# EAGLE design tinyha_blinds (EAGLE 7.5.0)
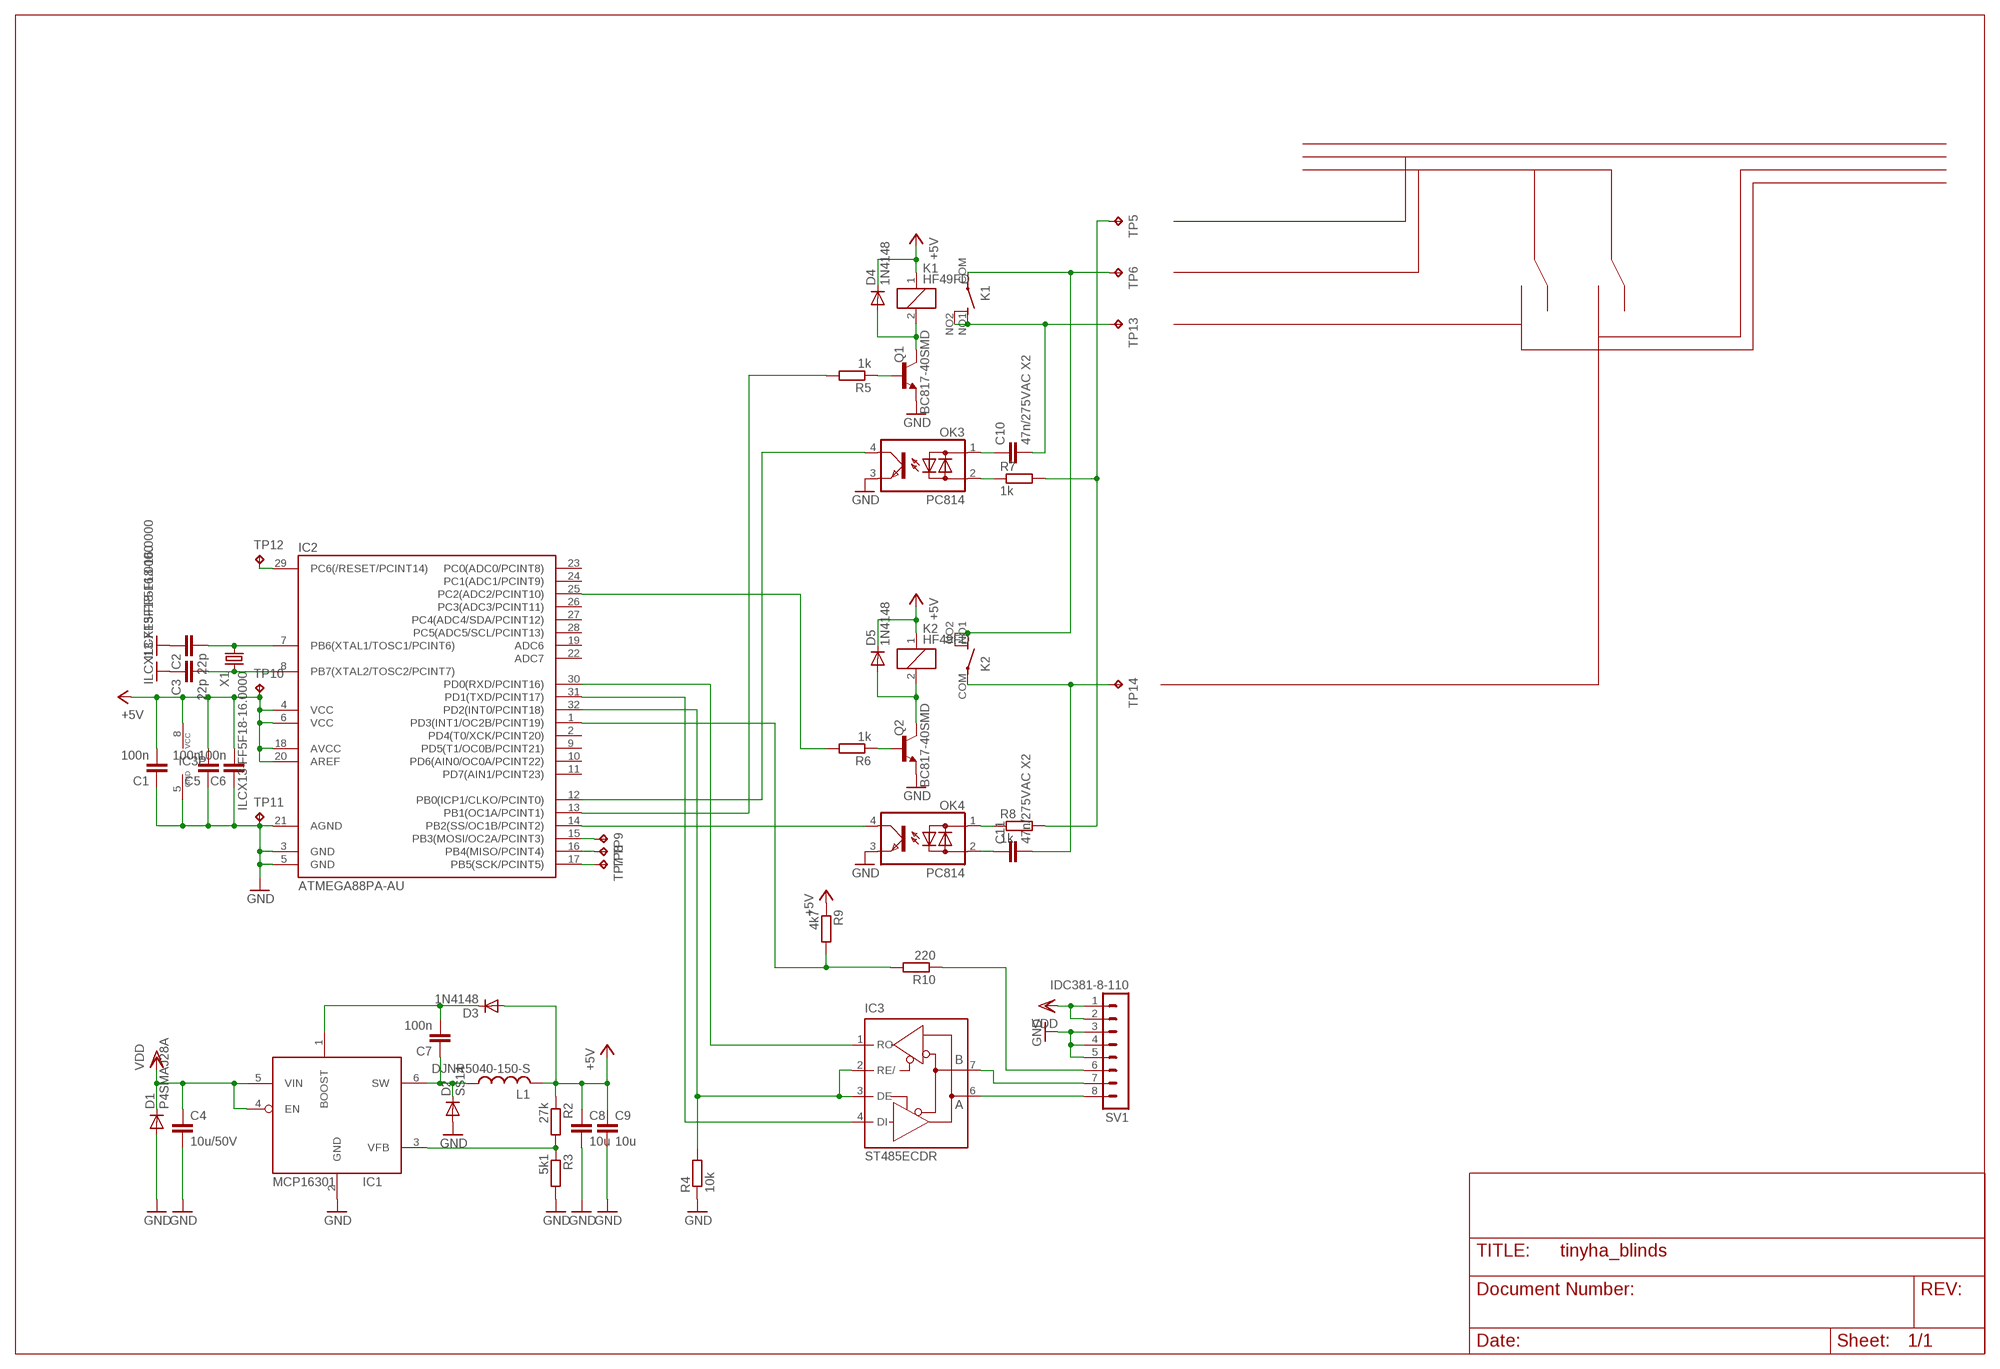
[diagram p0: schematic, sheet 1]

## Parts
C1  100n  C-EUC0603K  [C0603K]
C2  22p  C-EUC0603K  [C0603K]
C3  22p  C-EUC0603K  [C0603K]
C4  10u/50V  C-EUC1210K  [C1210K]
C5  100n  C-EUC0603K  [C0603K]
C6  100n  C-EUC0603K  [C0603K]
C7  100n  C-EUC0603K  [C0603K]
C8  10u  C-EUC0805K  [C0805K]
C9  10u  C-EUC0805K  [C0805K]
C10  47n/275VAC X2  C10/5  [C10B5]
C11  47n/275VAC X2  C10/5  [C10B5]
D1  P4SMAJ28A  DIODE-DO214AC  [DO214AC]
D2  SS14  DIODE-DO214AC  [DO214AC]
D3  1N4148  DIODE-MICROMELF-W  [MICROMELF-W]
D4  1N4148  DIODE-MICROMELF-W  [MICROMELF-W]
D5  1N4148  DIODE-MICROMELF-W  [MICROMELF-W]
IC1  MCP16301  [SOT23-6L]
IC2  ATMEGA88PA-AU  ATMEGA48/88/168-MU  [MLF32]
IC3  ST485ECDR  MAX481CSA  [SO08]
K1  HF49FD  [HF49D]
K2  HF49FD  [HF49D]
L1  DJNR5040-150-S  DJNR5040  [DJNR5040]
OK3  PC814  [DIL04]
OK4  PC814  [DIL04]
Q1  BC817-40SMD  [SOT23-BEC]
Q2  BC817-40SMD  [SOT23-BEC]
R2  27k  R-EU_R0603  [R0603]
R3  5k1  R-EU_R0603  [R0603]
R4  10k  R-EU_R0603  [R0603]
R5  1k  R-EU_R0603  [R0603]
R6  1k  R-EU_R0603  [R0603]
R7  1k  R-EU_0207/10  [0207/10]
R8  1k  R-EU_0207/10  [0207/10]
R9  4k7  R-EU_R0603  [R0603]
R10  220  R-EU_R0603  [R0603]
SV1  IDC381-8-110  MA08-1-IDC  [IDC381-8]
TP5  TP230  [P1-20]
TP6  TP230  [P1-20]
TP7  TPB1,27  [B1,27]
TP8  TPB1,27  [B1,27]
TP9  TPB1,27  [B1,27]
TP10  TPB1,27  [B1,27]
TP11  TPB1,27  [B1,27]
TP12  TPB1,27  [B1,27]
TP13  TP230  [P1-20]
TP14  TP230  [P1-20]
X1  ILCX13-FF5F18-16.0000  XTAL-3225  [SMD3225]

## Nets
+5V: C1.2 C5.2 C6.2 C8.1 C9.1 D3.A D4.C D5.C IC2.4(VCC) IC2.6(VCC) IC2.18(AVCC) IC2.20(AREF) IC3.8(VCC) K1.1 K2.1 L1.2 R2.1 R9.1 TP10.TP
DIR: IC2.32(PD2(INT0/PCINT18)) IC3.2(RE/) IC3.3(DE) R4.2
GND: C1.1 C2.1 C3.1 C4.2 C5.1 C6.1 C8.2 C9.2 D1.A D2.A IC1.2(GND) IC2.3(GND) IC2.5(GND) IC2.21(AGND) IC3.5(GND) OK3.3(E) OK4.3(E) Q1.E Q2.E R3.2 R4.1 SV1.3 SV1.4 SV1.5 TP11.TP X1.2(GND) X1.4(GND)
N$1: R7.2 R8.2 TP5.TP
N$2: C11.2 K2.COM(P) TP14.TP
N$3: C10.2 K1.NO1(S1) K1.NO2(S2) TP13.TP
N$4: Q2.B R6.1
N$5: Q1.B R5.1
N$6: IC2.13(PB1(OC1A/PCINT1)) R5.2
N$7: IC2.25(PC2(ADC2/PCINT10)) R6.2
N$8: IC2.29(PC6(/RESET/PCINT14)) TP12.TP
N$9: IC2.12(PB0(ICP1/CLKO/PCINT0)) OK3.4(C)
N$10: IC3.7(B) SV1.7
N$11: D5.A K2.2 Q2.C
N$12: IC2.14(PB2(SS/OC1B/PCINT2)) OK4.4(C)
N$13: OK4.1(AC1) R8.1
N$14: IC1.3(VFB) R2.2 R3.1
N$15: IC2.15(PB3(MOSI/OC2A/PCINT3)) TP9.TP
N$16: K1.COM(P) K2.NO1(S1) K2.NO2(S2) TP6.TP
N$17: C11.1 OK4.2(AC2)
N$18: R10.1 SV1.6
N$19: IC2.1(PD3(INT1/OC2B/PCINT19)) R9.2 R10.2
N$20: C7.1 D2.C IC1.6(SW) L1.1
N$21: D4.A K1.2 Q1.C
N$22: C7.2 D3.C IC1.1(BOOST)
N$23: IC3.6(A) SV1.8
N$24: C3.2 IC2.8(PB7(XTAL2/TOSC2/PCINT7)) X1.3
N$31: C2.2 IC2.7(PB6(XTAL1/TOSC1/PCINT6)) X1.1
N$55: C10.1 OK3.1(AC1)
N$56: OK3.2(AC2) R7.1
RXD: IC2.30(PD0(RXD/PCINT16)) IC3.1(RO)
TXD: IC2.31(PD1(TXD/PCINT17)) IC3.4(DI)
UH: IC2.16(PB4(MISO/PCINT4)) TP8.TP
VDD: C4.1 D1.C IC1.4(EN) IC1.5(VIN) SV1.1 SV1.2
WH: IC2.17(PB5(SCK/PCINT5)) TP7.TP
Unconnected: IC2.2(PD4(T0/XCK/PCINT20)) IC2.9(PD5(T1/OC0B/PCINT21)) IC2.10(PD6(AIN0/OC0A/PCINT22)) IC2.11(PD7(AIN1/PCINT23)) IC2.19(ADC6) IC2.22(ADC7) IC2.23(PC0(ADC0/PCINT8)) IC2.24(PC1(ADC1/PCINT9)) IC2.26(PC3(ADC3/PCINT11)) IC2.27(PC4(ADC4/SDA/PCINT12)) IC2.28(PC5(ADC5/SCL/PCINT13))

## Library data of the parts
C1-C9 = rcl:C-EU: CAPACITOR, European symbol
C10 C11 = capacitor-wima:C: CAPACITOR naming: grid - package width
D1-D5 = diode:DIODE-: DIODE
IC1 = custom:MCP16301
IC2 = atmega8:ATMEGA48/88/168
IC3 = maxim:MAX481CSA: RS485 TRANSEIVER; MF: MAXIM; MPN: MAX481CSA; OC_FARNELL: unknown; OC_NEWARK: 90C3817
K1 K2 = custom:HF49FD
L1 = custom:DJNR5040
OK3 OK4 = custom:PC814: SHARP OPTO COUPLER; OC_FARNELL: 9707662; OC_NEWARK: unknown
Q1 Q2 = transistor-npn:BC817*: NPN Transistor
R2-R10 = rcl:R-EU_: RESISTOR, European symbol
SV1 = custom:MA08-1: PIN HEADER
TP5 TP6 TP13 TP14 = custom:TP230
TP7-TP12 = testpad:TP: Test pad
X1 = custom:XTAL-3225

## Board
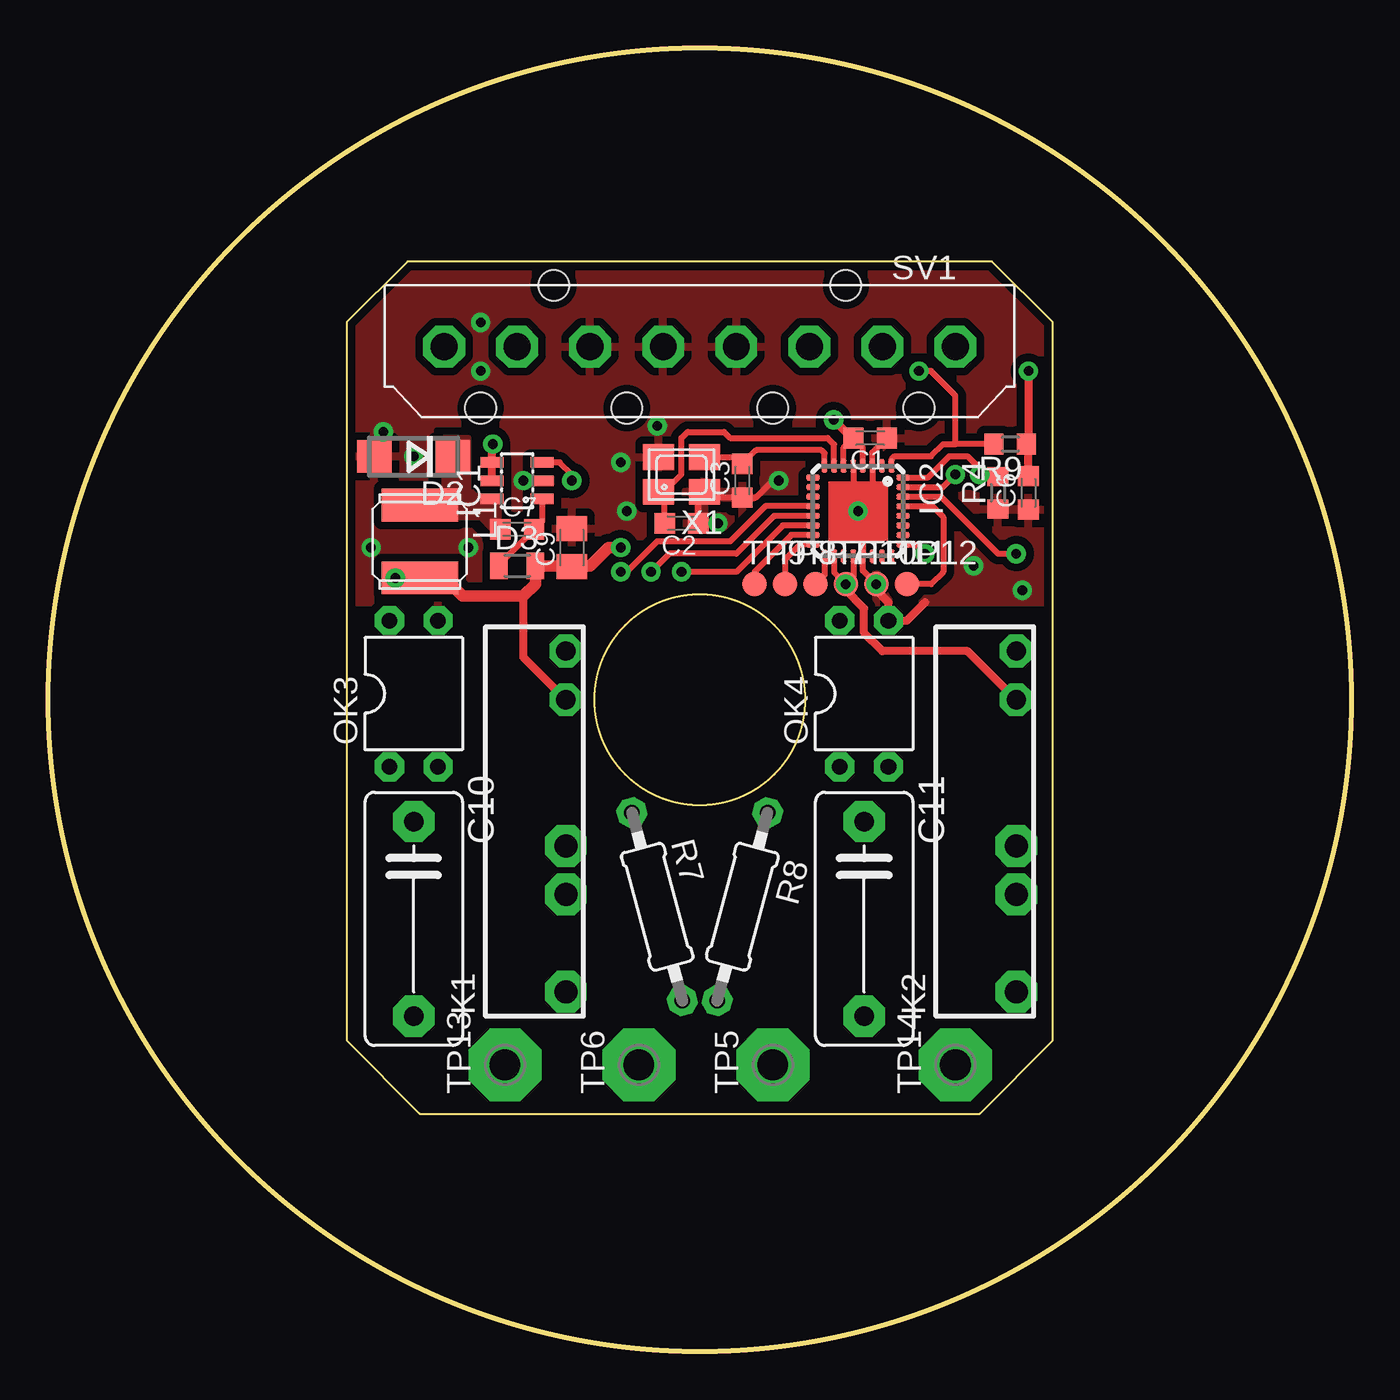
[diagram p1: board, top side]
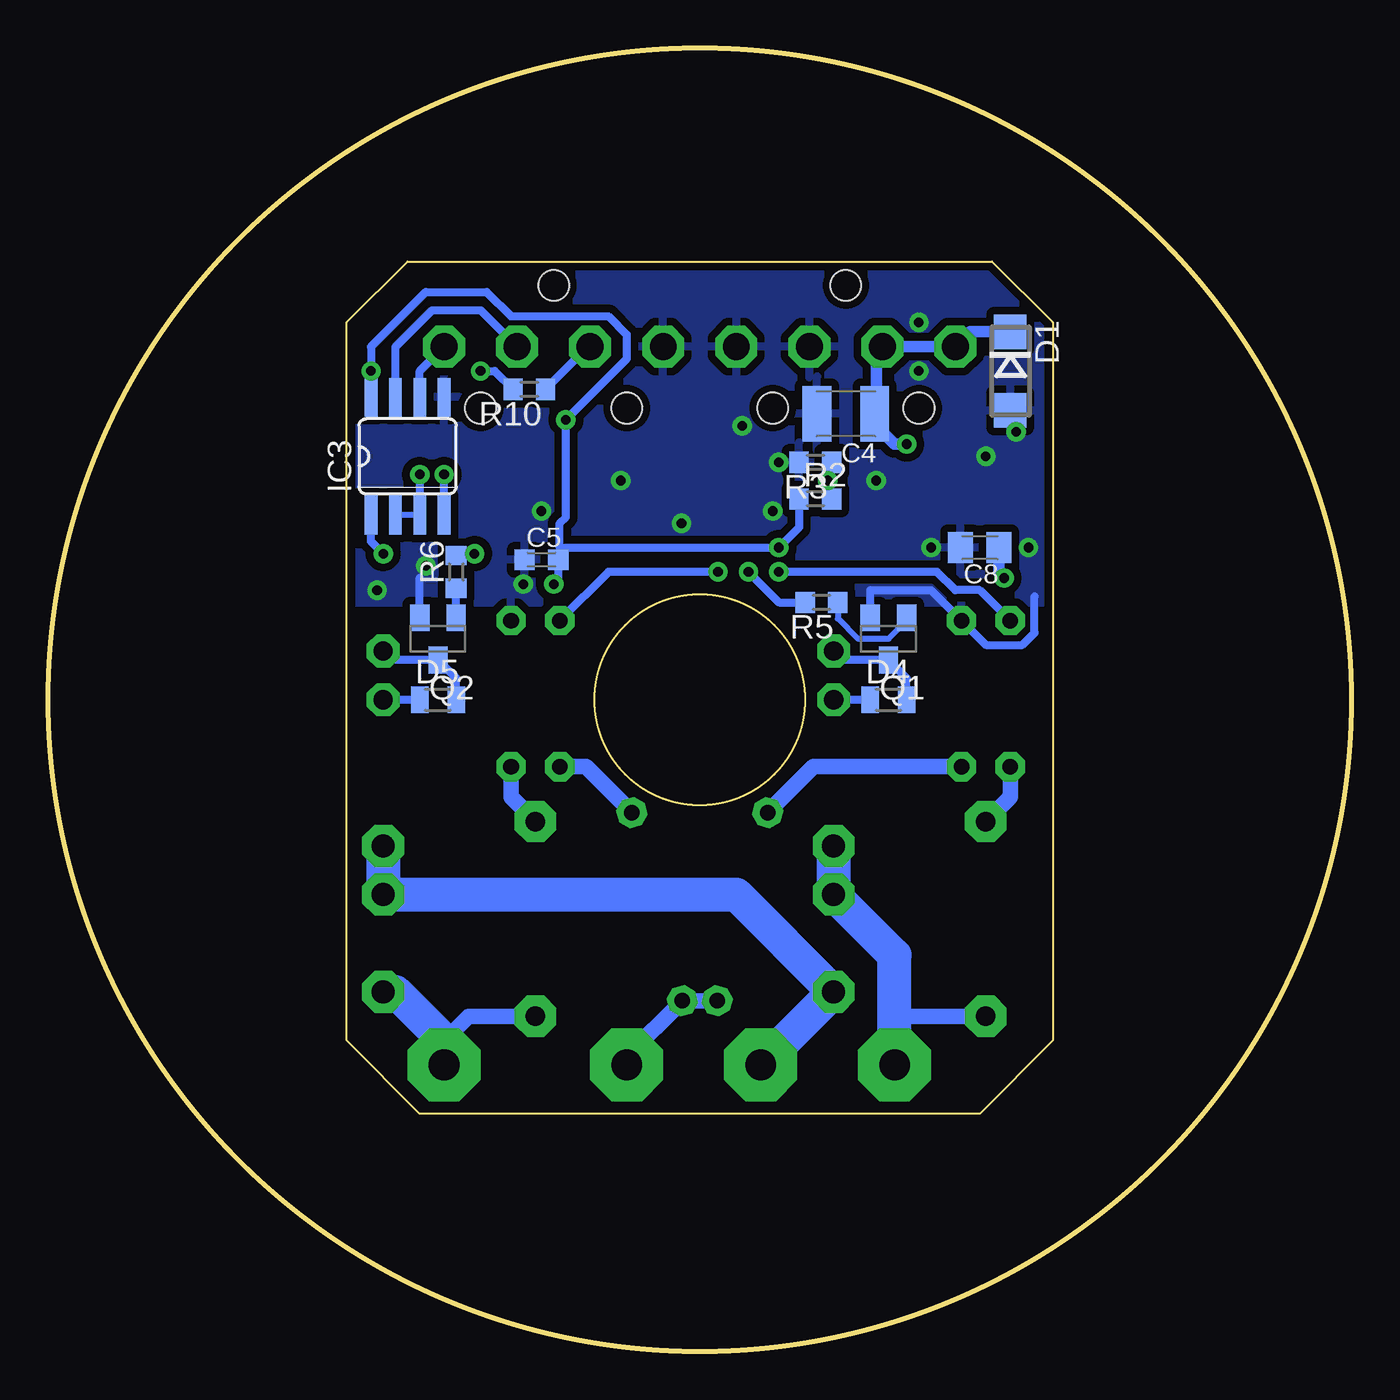
[diagram p2: board, bottom side, seen from below]

Size 68 x 68 mm. Coordinates in mm from the lower left corner, seen from the top.
Outline: 49.24,56.86 18.76,56.86 15.59,53.69 15.59,16.22 19.4,12.41 48.61,12.41 52.42,16.22 52.42,53.69 49.24,56.86
Outline: circle at 34,34 radius 34
Outline: circle at 34,34 radius 5.5
Copper layers (1*16): Top 0.035mm / dielectric 1.5mm / Bottom 0.035mm
Design rules "temp *": minimum track width 10mil, minimum drill 0.5mm, track to track 0.2mm, track to pad 0.2mm, pad to pad 0.2mm, via to via 0.2mm, smd to smd 0mil, copper to edge 16mil, drill to drill 8mil, minimum pad ring 14mil, minimum via ring 10mil, stop-mask expansion 4mil, vias tented up to drill 0.6mm, thermal gap 16mil

### Footprints (pad centres in the part's own frame; a part is rotated, then mirrored left to right if it is on the bottom)
C0603K = smd 1.05 x 1.08: 1 -0.875,0; 2 0.875,0
C1210K = smd 1.5 x 2.9: 1 -1.5,0; 2 1.5,0
C0805K = smd 1.3 x 1.6: 1 -1,0; 2 1,0
C10B5 = drill 1.016 pad 2.159 octagon: 1 -5.08,0; 2 5.08,0
DO214AC = smd 1.8 x 1.7: A 2.05,0; C -2.05,0
MICROMELF-W = smd 0.9 x 1.4: A 0.95,0; C -0.95,0
SOT23-6L = smd 0.55 x 1.2: 1 -0.95,-1.3; 2 0,-1.3; 3 0.95,-1.3; 4 0.95,1.3; 5 0,1.3; 6 -0.95,1.3
MLF32 = smd 0.7 x 0.3: 1 -2.35,1.75; 2 -2.35,1.25; 3 -2.35,0.75; 4 -2.35,0.25; 5 -2.35,-0.25; 6 -2.35,-0.75; 7 -2.35,-1.25; 8 -2.35,-1.75; 17 2.35,-1.75; 18 2.35,-1.25; 19 2.35,-0.75; 20 2.35,-0.25; 21 2.35,0.25; 22 2.35,0.75; 23 2.35,1.25; 24 2.35,1.75 | smd 0.3 x 0.7: 9 -1.75,-2.35; 10 -1.25,-2.35; 11 -0.75,-2.35; 12 -0.25,-2.35; 13 0.25,-2.35; 14 0.75,-2.35; 15 1.25,-2.35; 16 1.75,-2.35; 25 1.75,2.35; 26 1.25,2.35; 27 0.75,2.35; 28 0.25,2.35; 29 -0.25,2.35; 30 -0.75,2.35; 31 -1.25,2.35; 32 -1.75,2.35
SO08 = smd 0.66 x 2.032: 1 -1.905,-3.073; 2 -0.635,-3.073; 3 0.635,-3.073; 4 1.905,-3.073; 5 1.905,3.073; 6 0.635,3.073; 7 -0.635,3.073; 8 -1.905,3.073
HF49D = drill 1 pad 1.676 octagon: 1 7.62,0; 2 10.16,0 | drill 1.2 pad 2.184 octagon: COM -7.62,0; NO1 -2.54,0; NO2 0,0
DJNR5040 = smd 1.7 x 4: 1 -1.9,0; 2 1.9,0
DIL04 = drill 0.813 pad 1.422 octagon: 1 -1.27,-3.81; 2 1.27,-3.81; 3 1.27,3.81; 4 -1.27,3.81
SOT23-BEC = smd 1 x 1.4: B -0.95,-1.1; C 0,1.1; E 0.95,-1.1
R0603 = smd 1 x 1.1: 1 -0.85,0; 2 0.85,0
0207/10 = drill 0.813 octagon: 1 -5.08,0; 2 5.08,0
IDC381-8 = drill 1.4 pad 2.184 octagon: 1 -13.335,0; 2 -9.525,0; 3 -5.715,0; 4 -1.905,0; 5 1.905,0; 6 5.715,0; 7 9.525,0; 8 13.335,0 | hole 1.6: -11.43,-3.2; -3.81,-3.2; 3.81,-3.2; 11.43,-3.2; -7.62,3.2; 7.62,3.2
P1-20 = drill 1.6 pad 3.81 octagon: TP 0,0
B1,27 = smd 1.27 x 1.27: TP 0,0
SMD3225 = smd 1.6 x 1.35: 1 1.2,0.9; 2 -1.2,0.9; 3 -1.2,-0.9; 4 1.2,-0.9

### Placement (x,y rotation side)
C1  42.89,47.65 180 top
C2  33.05,43.21 180 top
C3  36.22,45.43 90 top
C4  26.38,48.92 180 bottom
C5  42.25,41.3 0 bottom
C6  51.14,44.8 90 top
C7  24.48,42.89 0 top
C8  19.4,41.94 180 bottom
C9  27.33,41.94 90 top
C10  19.08,22.57 270 top
C11  42.57,22.57 270 top
D1  17.81,51.14 270 bottom
D2  19.08,46.7 180 top
D3  24.48,40.98 0 top
D4  24.16,34 0 bottom
D5  47.65,34 0 bottom
IC1  24.48,45.43 90 top
IC2  42.25,43.84 270 top
IC3  49.24,46.7 0 bottom
K1  27.02,26.38 90 top
K2  50.51,26.38 90 top
L1  19.4,42.25 270 top
OK3  19.08,34.32 0 top
OK4  42.57,34.32 0 top
Q1  24.16,37.17 180 bottom
Q2  47.65,37.17 180 bottom
R2  27.97,44.48 0 bottom
R3  27.97,46.38 180 bottom
R4  49.56,44.8 90 top
R5  27.65,39.08 180 bottom
R6  46.7,40.67 90 bottom
R7  31.78,23.21 285 top
R8  36.22,23.21 255 top
R9  50.19,47.34 180 top
R10  42.89,50.19 180 bottom
SV1  34,52.42 0 top
TP5  37.81,14.95 90 top
TP6  30.82,14.95 90 top
TP7  40.03,40.03 0 top
TP8  38.45,40.03 0 top
TP9  36.86,40.03 0 top
TP10  41.62,40.03 0 top
TP11  43.21,40.03 0 top
TP12  44.8,40.03 0 top
TP13  23.84,14.95 90 top
TP14  47.34,14.95 90 top
X1  33.05,45.75 180 top

### Tracks (layer width: path | path; a pad name or v marks a point on that pad's centre or on a via)
+5V  (via drill 0.5)
  Top 0.305: IC2.18 41.01,40.65 TP10.TP 42,40.42 IC2.20 | IC2.4 42.5,47.16 C1.2 41.51,47.14 IC2.6
  Top 0.406: 19.78,39.97 L1.2 | C1.2 41.94,47.65 v40.98,48.61 | 24.79,39.4 24.79,36.22 K1.1 | K2.1 47.97,36.54 43.53,36.54 42.57,37.49 42.57,38.76 41.62,39.72 TP10.TP | C9.1 27.06,40.94 27.02,40.98 | v51.14,51.14 51.14,47.44 R9.1 51.14,47.23 C6.2
  Top 0.61: L1.2 20.66,40.35 21.62,39.4 24.79,39.4 25.43,40.03 D3.A 27.02,40.98 | v18.12,40.35 L1.2 | v29.87,41.94 29.24,41.94 28.29,40.98 27.38,40.98 C9.1
  Top 0.813: L1.2
  Bottom 0.406: TP10.TP 41.38,40.27 C5.2 41.3,41.38 41.3,41.94 | 41.3,41.94 41.3,43.21 40.98,43.53 v40.98,48.61 37.81,51.78 37.81,53.05 38.76,54 43.84,54 45.11,55.27 48.29,55.27 51.14,52.42 v51.14,51.14 IC3.8 | D4.C K1.1 | D5.C K2.1 | R2.1 28.82,42.99 v29.87,41.94 41.3,41.94
  Bottom 0.61: C8.1 18.4,40.62 v18.12,40.35
  other vias: 41.62,40.03
DIR  (via drill 0.5)
  Top 0.305: v48.61,45.75 48.61,46.06 47.97,46.7 47.02,46.7 45.91,45.59 IC2.32
  Top 0.406: v48.61,45.75 49.45,45.75 R4.2
  Bottom 0.305: IC3.3 IC3.2
  Bottom 0.406: v48.61,45.75 IC3.3
GND  (via drill 0.5)
  Top 0.305: C1.1 43,46.89 IC2.3 43,44.59 v42.25,43.84 | IC2.5 42,44.09 v42.25,43.84 | v42.25,43.84 42.5,43.59 IC2.21 42.5,40.73 TP11.TP | C2.1 33.92,44.52 X1.2 34.54,44.56 C3.1 36.94,44.56 37.81,45.43 v38.13,45.43
  Top 0.406: TP11.TP 43.21,39.72 43.84,39.08 OK4.3 44.8,38.13 45.75,39.08
  Bottom 0.406: 16.54,39.4 16.54,37.49 17.17,36.86 19.08,36.86 OK3.3 21.94,39.72 25.11,39.72 25.11,39.71 Q1.E | Q2.E 48.6,40.35 48.61,40.35
  other vias: 24.79,45.43 43.21,40.03 31.78,48.29 30.19,43.84 29.87,46.38 21.94,41.94 16.86,41.94 17.49,47.97 22.57,53.69 22.57,51.14 19.08,46.7 50.83,39.72 48.29,40.98 34.95,43.21
  pour Top (isolate 0.406, rank 2): 15.59,56.86 52.42,56.86 52.42,39.08 15.59,39.08
  pour Bottom (isolate 0.406): 15.59,56.86 52.42,56.86 52.42,39.08 15.59,39.08
N$1
  Bottom 0.813: R7.2 R8.2 37.81,15.4 TP5.TP
N$2
  Bottom 0.813: C11.2 46.06,17.49 47.34,16.22
  Bottom 1.778: K2.COM 49.88,18.76 47.34,16.22 TP14.TP
N$3
  Bottom 0.813: C10.2 23.84,17.49
  Bottom 1.778: TP13.TP 23.84,17.49 23.84,20.66 K1.NO1 K1.NO2
N$4
  Bottom 0.406: Q2.B R6.1
N$5
  Bottom 0.305: Q1.B 23.21,38.12 24.16,37.17 25.75,37.17 26.8,38.23 R5.1
N$6  (via drill 0.5)
  Top 0.305: IC2.13 37.88,43.59 35.91,41.62 32.41,41.62 v31.46,40.67
  Bottom 0.406: v31.46,40.67 29.87,39.08 R5.2
N$7  (via drill 0.5)
  Top 0.305: IC2.25 45.28,42.09 v45.75,41.62
  Bottom 0.406: v45.75,41.62 46.6,41.62 R6.2
N$8
  Top 0.305: 45.18,44.09 IC2.29 46.13,44.09 46.7,43.53 46.7,40.67 46.06,40.03 TP12.TP
N$9  (via drill 0.5)
  Top 0.305: IC2.12 37.42,44.09 35.59,42.25 31.78,42.25 30.19,40.67 v29.87,40.67
  Bottom 0.406: v29.87,40.67 21.62,40.67 20.66,39.72 19.4,39.72 OK3.4
N$10
  Bottom 0.406: IC3.7 49.88,52.42 47.97,54.32 45.43,54.32 SV1.7
N$11
  Bottom 0.406: D5.A 46.7,35.12 Q2.C 50.05,36.08 K2.2
N$12  (via drill 0.5)
  Top 0.305: IC2.14 38.33,43.09 35.91,40.67 v33.05,40.67
  Bottom 0.406: v33.05,40.67 38.76,40.67 OK4.4
N$13
  Bottom 0.813: OK4.1 39.93,30.51 R8.1
N$14  (via drill 0.5)
  Top 0.305: v27.33,45.43 27.33,45.75 26.7,46.38 IC1.3
  Bottom 0.305: R2.2 27.33,44.69 v27.33,45.43 27.33,46.17 R3.1
N$15
  Top 0.305: IC2.15 38.78,42.59 36.86,40.67 TP9.TP
N$16
  Bottom 1.778: TP6.TP K1.COM 32.09,23.84 K2.NO1 K2.NO2
N$17
  Bottom 0.813: OK4.2 43.84,28.92 C11.1
N$18
  Bottom 0.406: SV1.6 39.82,52.42 R10.1
N$19  (via drill 0.5)
  Top 0.305: IC2.1 44,46.55 44.16,46.7 46.06,46.7 46.7,47.34 47.34,47.34 | R9.2 47.34,47.34 | 47.34,47.34 47.34,49.88 46.06,51.14 v45.43,51.14
  Bottom 0.406: v45.43,51.14 44.69,51.14 R10.2
N$20
  pour Top (isolate 0.406, no thermals): 20.66,47.65 20.66,43.53 22.57,43.53 23.21,42.89 23.52,42.89 23.52,44.8 21.94,44.8 21.94,47.65
N$21
  Bottom 0.406: K1.2 26.55,36.08 Q1.C 23.21,35.12 D4.A
N$22
  Top 0.305: IC1.1 25.77,43.31 C7.2 23.52,41.06 D3.C
N$23
  Bottom 0.406: IC3.6 48.61,51.14 SV1.8
N$24
  Top 0.305: IC2.8 40.51,46.86 40.35,47.02 36.94,47.02 C3.2 35.88,46.65 X1.3
N$31
  Top 0.305: IC2.7 41.01,47.31 40.67,47.65 35.59,47.65 35.27,47.97 33.37,47.97 33.05,47.65 33.05,45.75 32.15,44.85 X1.1 32.17,44.52 C2.2
N$55
  Bottom 0.813: OK3.1 17.81,28.92 C10.1
N$56
  Bottom 0.813: OK3.2 28.07,30.51 R7.1
RXD  (via drill 0.5)
  Top 0.305: v50.51,41.62 49.56,41.62 46.59,44.59 IC2.30
  Bottom 0.406: v50.51,41.62 51.14,42.25 IC3.1
TXD  (via drill 0.5)
  Top 0.305: IC2.31 46.68,45.09 v47.34,45.75
  Bottom 0.406: IC3.4 v47.34,45.75
UH
  Top 0.305: IC2.16 39.23,42.09 38.45,41.3 TP8.TP
VDD  (via drill 0.5)
  Top 0.406: IC1.5 IC1.4 23.18,47.31 v23.21,47.34
  Bottom 0.61: 24.79,49.01 24.79,51.46 24.48,51.78 SV1.2 SV1.1 19.89,53.2 D1.C | v23.21,47.34 23.84,47.34 25.11,48.61 25.11,48.69 C4.1
  Bottom 0.813: 24.79,49.01 C4.1 24.79,48.84
WH
  Top 0.305: IC2.17 40.51,40.51 TP7.TP

### Text on the board
potisk: EMIR2 shield | alpov v4/2014